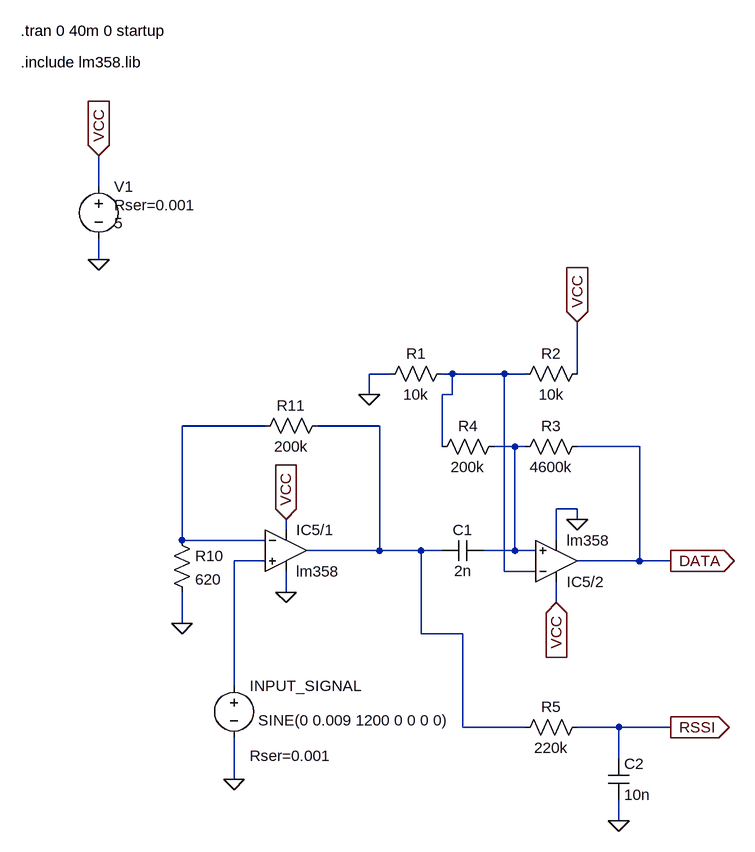
[diagram p0: schematic receiver.asc]
receiver.asc, the LTspice schematic file:
Version 4
SHEET 1 4680 2660
WIRE -1040 640 -1040 592
WIRE -1040 752 -1040 720
WIRE -592 928 -624 928
WIRE -496 928 -512 928
WIRE -416 928 -496 928
WIRE -384 928 -416 928
WIRE -304 928 -304 848
WIRE -624 960 -624 928
WIRE -496 960 -496 928
WIRE -496 960 -512 960
WIRE -784 1008 -912 1008
WIRE -608 1008 -704 1008
WIRE -512 1040 -512 960
WIRE -400 1040 -432 1040
WIRE -384 1040 -400 1040
WIRE -208 1040 -304 1040
WIRE -304 1136 -336 1136
WIRE -304 1152 -304 1136
WIRE -752 1168 -752 1152
WIRE -912 1184 -912 1008
WIRE -784 1184 -912 1184
WIRE -336 1184 -336 1136
WIRE -608 1200 -608 1008
WIRE -608 1200 -720 1200
WIRE -544 1200 -608 1200
WIRE -512 1200 -544 1200
WIRE -400 1200 -400 1040
WIRE -400 1200 -448 1200
WIRE -368 1200 -400 1200
WIRE -784 1216 -832 1216
WIRE -208 1216 -208 1040
WIRE -208 1216 -304 1216
WIRE -160 1216 -208 1216
WIRE -416 1232 -416 928
WIRE -368 1232 -416 1232
WIRE -752 1264 -752 1232
WIRE -336 1280 -336 1248
WIRE -912 1312 -912 1264
WIRE -544 1328 -544 1200
WIRE -480 1328 -544 1328
WIRE -832 1408 -832 1216
WIRE -480 1472 -480 1328
WIRE -384 1472 -480 1472
WIRE -240 1472 -304 1472
WIRE -160 1472 -240 1472
WIRE -240 1520 -240 1472
WIRE -832 1552 -832 1488
WIRE -240 1616 -240 1584
FLAG -912 1312 0
FLAG -1040 752 0
FLAG -1040 592 VCC
IOPIN -1040 592 In
FLAG -752 1264 0
FLAG -752 1152 VCC
IOPIN -752 1152 In
FLAG -336 1280 VCC
IOPIN -336 1280 In
FLAG -832 1552 0
FLAG -304 1152 0
FLAG -160 1216 DATA
IOPIN -160 1216 Out
FLAG -624 960 0
FLAG -304 848 VCC
IOPIN -304 848 In
FLAG -240 1616 0
FLAG -160 1472 RSSI
IOPIN -160 1472 Out
SYMBOL res -688 992 R90
WINDOW 0 0 56 VBottom 2
WINDOW 3 32 56 VTop 2
SYMATTR InstName R11
SYMATTR Value 200k
SYMBOL res -928 1168 R0
SYMATTR InstName R10
SYMATTR Value 620
SYMBOL voltage -832 1392 R0
WINDOW 123 0 0 Left 0
WINDOW 39 24 124 Left 2
WINDOW 3 37 69 Left 2
SYMATTR SpiceLine Rser=0.001
SYMATTR Value SINE(0 0.009 1200 0 0 0 0)
SYMATTR InstName INPUT_SIGNAL
SYMBOL Opamps\\opamp2 -336 1280 M180
SYMATTR InstName IC5/2
SYMATTR Value lm358
SYMBOL Opamps\\opamp2 -752 1136 R0
SYMATTR InstName IC5/1
SYMATTR Value lm358
SYMBOL voltage -1040 624 R0
WINDOW 3 24 72 Left 2
WINDOW 123 0 0 Left 0
WINDOW 39 24 44 Left 2
SYMATTR Value 5
SYMATTR SpiceLine Rser=0.001
SYMATTR InstName V1
SYMBOL cap -448 1184 R90
WINDOW 0 0 32 VBottom 2
WINDOW 3 32 32 VTop 2
SYMATTR InstName C1
SYMATTR Value 2n
SYMBOL res -496 912 R90
WINDOW 0 0 56 VBottom 2
WINDOW 3 32 56 VTop 2
SYMATTR InstName R1
SYMATTR Value 10k
SYMBOL res -288 912 R90
WINDOW 0 0 56 VBottom 2
WINDOW 3 32 56 VTop 2
SYMATTR InstName R2
SYMATTR Value 10k
SYMBOL res -288 1024 R90
WINDOW 0 0 56 VBottom 2
WINDOW 3 32 56 VTop 2
SYMATTR InstName R3
SYMATTR Value 4600k
SYMBOL res -416 1024 R90
WINDOW 0 0 56 VBottom 2
WINDOW 3 32 56 VTop 2
SYMATTR InstName R4
SYMATTR Value 200k
SYMBOL res -288 1456 R90
WINDOW 0 0 56 VBottom 2
WINDOW 3 32 56 VTop 2
SYMATTR InstName R5
SYMATTR Value 220k
SYMBOL cap -256 1520 R0
SYMATTR InstName C2
SYMATTR Value 10n
TEXT -1160 400 Left 2 !.tran 0 40m 0 startup
TEXT -1160 448 Left 2 !.include lm358.lib

The netlist it stands for:
* receiver.asc
R11 N003 N002 200k
R10 N002 0 620
V§INPUT_SIGNAL N005 0 SINE(0 0.009 1200 0 0 0 0) Rser=0.001
XIC5/2 N004 N001 VCC 0 DATA lm358  ; pins In+ In- V+ V- OUT
XIC5/1 N005 N002 VCC 0 N003 lm358  ; pins In+ In- V+ V- OUT
V1 VCC 0 5 Rser=0.001
C1 N004 N003 2n
R1 N001 0 10k
R2 VCC N001 10k
R3 DATA N004 4600k
R4 N004 N001 200k
R5 RSSI N003 220k
C2 RSSI 0 10n
.tran 0 40m 0 startup
.include lm358.lib
.backanno
.end